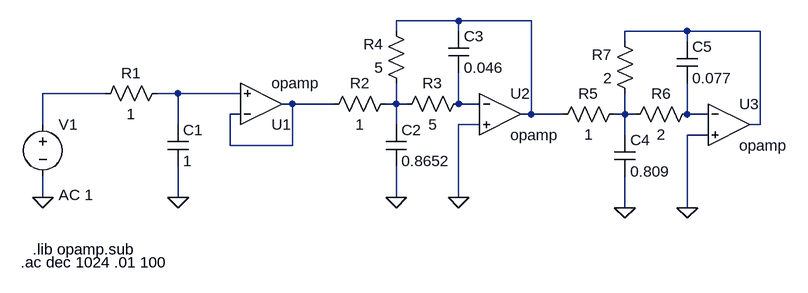
[diagram p0: schematic EJ3b_TP2.asc]
EJ3b_TP2.asc, the LTspice schematic file:
Version 4
SHEET 1 1060 680
WIRE 592 -32 496 -32
WIRE 704 -32 592 -32
WIRE 496 -16 496 -32
WIRE 592 -16 592 -32
WIRE 944 -16 848 -16
WIRE 1056 -16 944 -16
WIRE 848 0 848 -16
WIRE 944 0 944 -16
WIRE 48 80 -48 80
WIRE 160 80 128 80
WIRE 256 80 160 80
WIRE 336 96 320 96
WIRE 400 96 336 96
WIRE 496 96 496 64
WIRE 496 96 480 96
WIRE 512 96 496 96
WIRE 592 96 592 48
WIRE 624 96 592 96
WIRE 256 112 240 112
WIRE 704 112 704 -32
WIRE 704 112 688 112
WIRE 752 112 704 112
WIRE 848 112 848 80
WIRE 848 112 832 112
WIRE 864 112 848 112
WIRE 944 112 944 64
WIRE 976 112 944 112
WIRE -48 128 -48 80
WIRE 160 128 160 80
WIRE 496 128 496 96
WIRE 624 128 592 128
WIRE 1056 128 1056 -16
WIRE 1056 128 1040 128
WIRE 848 144 848 112
WIRE 976 144 944 144
WIRE 240 160 240 112
WIRE 336 160 336 96
WIRE 336 160 240 160
WIRE -48 240 -48 208
WIRE 160 240 160 192
WIRE 496 240 496 192
WIRE 592 240 592 128
WIRE 848 256 848 208
WIRE 944 256 944 144
FLAG 160 240 0
FLAG -48 240 0
FLAG 496 240 0
FLAG 848 256 0
FLAG 592 240 0
FLAG 944 256 0
SYMBOL voltage -48 112 R0
WINDOW 123 24 124 Left 2
WINDOW 39 0 0 Left 0
SYMATTR InstName V1
SYMATTR Value ""
SYMATTR Value2 AC 1
SYMBOL res 144 64 R90
WINDOW 0 0 56 VBottom 2
WINDOW 3 32 56 VTop 2
SYMATTR InstName R1
SYMATTR Value 1
SYMBOL cap 144 128 R0
SYMATTR InstName C1
SYMATTR Value 1
SYMBOL OpAmps\\opamp 288 160 M180
SYMATTR InstName U1
SYMBOL OpAmps\\opamp 656 48 R0
SYMATTR InstName U2
SYMBOL res 496 80 R90
WINDOW 0 0 56 VBottom 2
WINDOW 3 32 56 VTop 2
SYMATTR InstName R2
SYMATTR Value 1
SYMBOL res 608 80 R90
WINDOW 0 0 56 VBottom 2
WINDOW 3 32 56 VTop 2
SYMATTR InstName R3
SYMATTR Value 5
SYMBOL res 512 80 R180
WINDOW 0 36 76 Left 2
WINDOW 3 36 40 Left 2
SYMATTR InstName R4
SYMATTR Value 5
SYMBOL cap 480 128 R0
SYMATTR InstName C2
SYMATTR Value 0.8652
SYMBOL cap 576 -16 R0
SYMATTR InstName C3
SYMATTR Value 0.046
SYMBOL OpAmps\\opamp 1008 64 R0
SYMATTR InstName U3
SYMBOL res 848 96 R90
WINDOW 0 0 56 VBottom 2
WINDOW 3 32 56 VTop 2
SYMATTR InstName R5
SYMATTR Value 1
SYMBOL res 960 96 R90
WINDOW 0 0 56 VBottom 2
WINDOW 3 32 56 VTop 2
SYMATTR InstName R6
SYMATTR Value 2
SYMBOL res 864 96 R180
WINDOW 0 36 76 Left 2
WINDOW 3 36 40 Left 2
SYMATTR InstName R7
SYMATTR Value 2
SYMBOL cap 832 144 R0
SYMATTR InstName C4
SYMATTR Value 0.809
SYMBOL cap 928 0 R0
SYMATTR InstName C5
SYMATTR Value 0.077
TEXT -64 320 Left 2 !.lib opamp.sub
TEXT -82 340 Left 2 !.ac dec 1024 .01 100

The netlist it stands for:
* EJ3b_TP2.asc
V1 N003 0 AC 1
R1 N004 N003 1
C1 N004 0 1
XU1 N005 N004 N005 opamp Aol=100K GBW=10Meg  ; pins invin noninvin out
XU2 N007 0 N001 opamp Aol=100K GBW=10Meg  ; pins invin noninvin out
R2 N006 N005 1
R3 N007 N006 5
R4 N006 N001 5
C2 N006 0 0.8652
C3 N001 N007 0.046
XU3 N009 0 N002 opamp Aol=100K GBW=10Meg  ; pins invin noninvin out
R5 N008 N001 1
R6 N009 N008 2
R7 N008 N002 2
C4 N008 0 0.809
C5 N002 N009 0.077
.lib opamp.sub
.ac dec 1024 .01 100
.backanno
.end